# Altium schematic sheet obc_can_transceiver (1).SchDoc
size A4
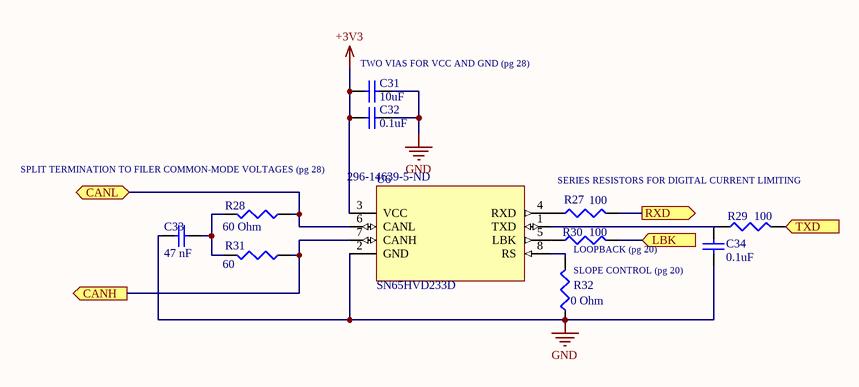
[diagram p0: obc_can_transceiver (1).SchDoc]

## Parts
C31  value 10uF  [1608[0603]]  (hidden comment: Cap Semi)
C32  value 0.1uF  [1608[0603]]  (hidden comment: Cap Semi)
C33  value 47 nF  [1608[0603]]  (hidden comment: Ceramic)
C34  0.1uF  [1608[0603]]
R27  value 100  [J1-0603]
R28  value 60 Ohm  [J1-0603]  (hidden comment: 0603)
R29  value 100  [J1-0603]
R30  100  [J1-0603]
R31  value 60  [J1-0603]  (hidden comment: 0603)
R32  value 0 Ohm  [J1-0603]
U6  SN65HVD233D  Supplier Part Number 1: 296-14639-5-ND  [SOIC127P500X600-8N]

## Ports
CANH (out), CANL (bidir), LBK (in), RXD (out), TXD (in)

## Nets
+3V3: C31.2 C32.2 U6.3(VCC)
GND: C31.1 C32.1 C33.1 C34.1 R32.1 U6.2(GND)
CANH: R31.1 U6.7(CANH) ; port CANH
CANL: R28.1 U6.6(CANL) ; port CANL
LBK: R30.2 ; port LBK
RXD: R27.2 ; port RXD
TXD: R29.2 ; port TXD
NetC33_2: C33.2 R28.2 R31.2
NetC34_2: C34.2 R29.1 U6.1(TXD)
NetR27_1: R27.1 U6.4(RXD)
NetR30_1: R30.1 U6.5(LBK)
NetR32_2: R32.2 U6.8(RS)

## Notes on the sheet
- (near C31) TWO VIAS FOR VCC AND GND (pg 28)
- SPLIT TERMINATION TO FILER COMMON-MODE VOLTAGES (pg 28)
- SERIES RESISTORS FOR DIGITAL CURRENT LIMITING
- (near R32) SLOPE CONTROL (pg 20)
- (near R30) LOOPBACK (pg 20)

## Library data of the parts
C31-C34 = Cap Semi: Capacitor (Semiconductor SIM Model); Published: 8-Jun-2000; LatestRevisionDate: 29-May-2009; LatestRevisionNote: IPC-7351 Footprint Added.; PackageReference: C1206; Publisher: Altium Limited; PackageDescription: Chip Capacitor
  C34: Value: 0.1uF
R27-R32 = Res3: Resistor; Published: 8-Jun-2000; LatestRevisionDate: 29-May-2009; LatestRevisionNote: IPC-7351 Footprint Added.; PackageReference: J1-0603; Publisher: Altium Limited; PackageDescription: Chip Resistor
  R30: Value: 100
U6 = SN65HVD233D: 3.3V CAN Transceiver with Standby Mode, Loop-back 8-SOIC -40 to 125; MF: Texas Instruments; MP: SN65HVD233D; Package: SOIC-8 Texas Instruments; Availability: Good; SnapEDA_Link: https://www.snapeda.com/parts/SN65HVD233D/Texas%20Instruments/view-part/?ref=snap; Price: 2.39 USD; Value: *; Supplier 1: Digi-Key